# EAGLE design XU1541Mini (EAGLE 6.6.0)
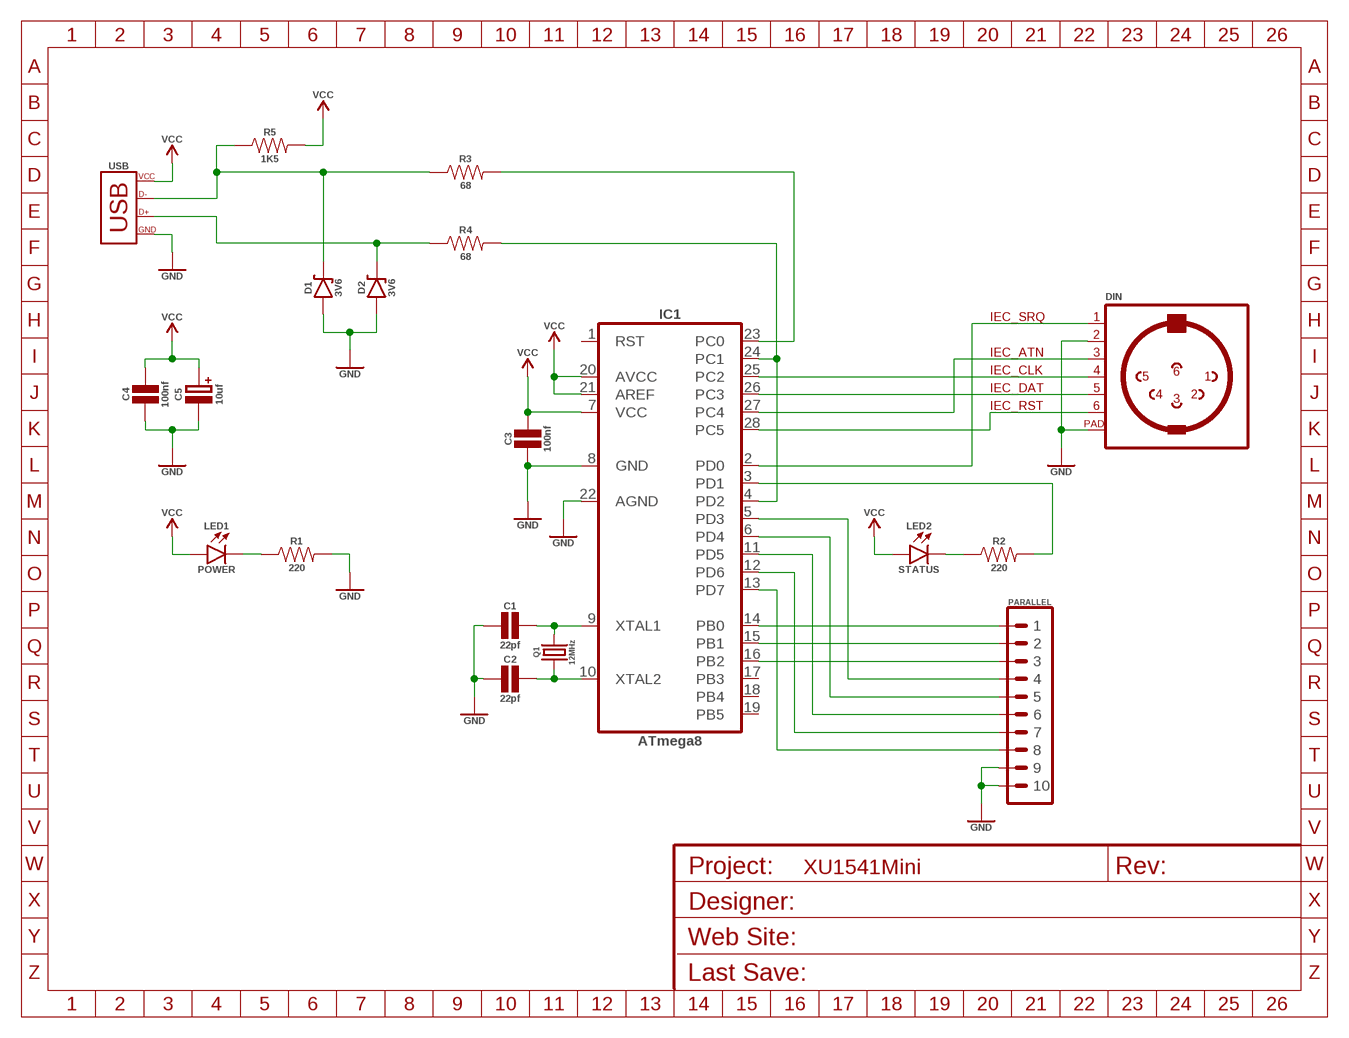
[diagram p0: schematic, sheet 1]
FRAME1 (FRAME_A5L): DESIGNER: Simon/CGTr; REVISION: 1.00; WEBSITE: http://www.commodore.gen.tr

## Parts
C1  22pf  CAPACITOR_CERAMIC_0.1  [CAPACITOR_CERAMIC_0.1]
C2  22pf  CAPACITOR_CERAMIC_0.1  [CAPACITOR_CERAMIC_0.1]
C3  100nf  CAPACITOR_CERAMIC_0.1  [CAPACITOR_CERAMIC_0.1]
C4  100nf  CAPACITOR_CERAMIC_0.1  [CAPACITOR_CERAMIC_0.1]
C5  10uf  CAPACITOR_POLARIZED_0.1  [CAPACITOR_POLARIZED_0.1]
D1  3V6  DIODE_ZENER_0.3  [DIODE_ZENER_0.3]
D2  3V6  DIODE_ZENER_0.3  [DIODE_ZENER_0.3]
DIN  DIN6  [DIN6]
IC1  ATmega8  MCU_ATMEGA8-16PU  [DIP28]
JP1  PARALLEL  HDR_2X05  [HDR_2X05]
LED1  POWER  LED_NORMAL_03MM  [LED_03MM]
LED2  STATUS  LED_NORMAL_03MM  [LED_03MM]
Q1  12MHz  XTAL_HC49  [XTAL_HC49]
R1  220  RESISTOR_THT_0.3  [RESISTOR_THT_0.3]
R2  220  RESISTOR_THT_0.3  [RESISTOR_THT_0.3]
R3  68  RESISTOR_THT_0.3  [RESISTOR_THT_0.3]
R4  68  RESISTOR_THT_0.3  [RESISTOR_THT_0.3]
R5  1K5  RESISTOR_THT_0.3  [RESISTOR_THT_0.3]
USB  USB_TYPEB_THT  [USB_TYPEB_THT]

## Nets
3@1: IC1.3(PD1) R2.2
3@2: LED2.CATHODE(C) R2.1
D+@1: D2.C(CATHODE) R4.1 USB.D+
D+@2: IC1.4(PD2) IC1.24(PC1) R4.2
D-@1: D1.C(CATHODE) R3.1 R5.1 USB.D-
D-@2: IC1.23(PC0) R3.2
GND: C1.1 C2.1 C3.1 C4.1 C5.2(-) D1.A(ANODE) D2.A(ANODE) DIN.2 DIN.PAD@1(PAD) DIN.PAD@2(PAD) IC1.8(GND) IC1.22(AGND) JP1.9 JP1.10 R1.2 USB.GND USB.PAD@1(GND) USB.PAD@2(GND)
IEC_ATN: DIN.3 IC1.27(PC4)
IEC_CLK: DIN.4 IC1.25(PC2)
IEC_DAT: DIN.5 IC1.26(PC3)
IEC_RST: DIN.6 IC1.28(PC5)
IEC_SRQ: DIN.1 IC1.2(PD0)
N$1: IC1.14(PB0) JP1.1
N$2: IC1.15(PB1) JP1.2
N$3: IC1.16(PB2) JP1.3
N$4: IC1.5(PD3) JP1.4
N$5: IC1.6(PD4) JP1.5
N$6: IC1.11(PD5) JP1.6
N$7: IC1.12(PD6) JP1.7
N$8: IC1.13(PD7) JP1.8
PWRLED: LED1.CATHODE(C) R1.1
VCC: C3.2 C4.2 C5.1(+) IC1.7(VCC) IC1.20(AVCC) IC1.21(AREF) LED1.ANODE(A) LED2.ANODE(A) R5.2 USB.VCC
XTAL1: C1.2 IC1.9(XTAL1) Q1.2
XTAL2: C2.2 IC1.10(XTAL2) Q1.1
Unconnected: IC1.1(RST) IC1.17(PB3) IC1.18(PB4) IC1.19(PB5)

## Notes on the sheet
- IEC_SRQ
- IEC_ATN
- IEC_CLK
- IEC_DAT
- IEC_RST

## Library data of the parts
C1-C4 = sj_standart:CAPACITOR_CERAMIC: Ceramic Capacitor
C5 = sj_standart:CAPACITOR_POLARIZED: Capacitor Polarized
D1 D2 = sj_standart:DIODE_ZENER: Zener Diode
DIN = sj_connectors:DIN6: 6pin DIN Connector
IC1 = sj_standart:MCU_ATMEGA8: ATMEGA8 MCU - 8 KB FLASH, 1 KB SRAM, 512 bytes EEPROM
JP1 = sj_connectors:HDR_2X05: 2x05 - 0.1" Pin Header
LED1 LED2 = sj_standart:LED_NORMAL: Standard LED
Q1 = sj_standart:XTAL: CRYSTAL
R1-R5 = sj_standart:RESISTOR: Resistor
USB = sj_connectors:USB: USB Connector

## Board
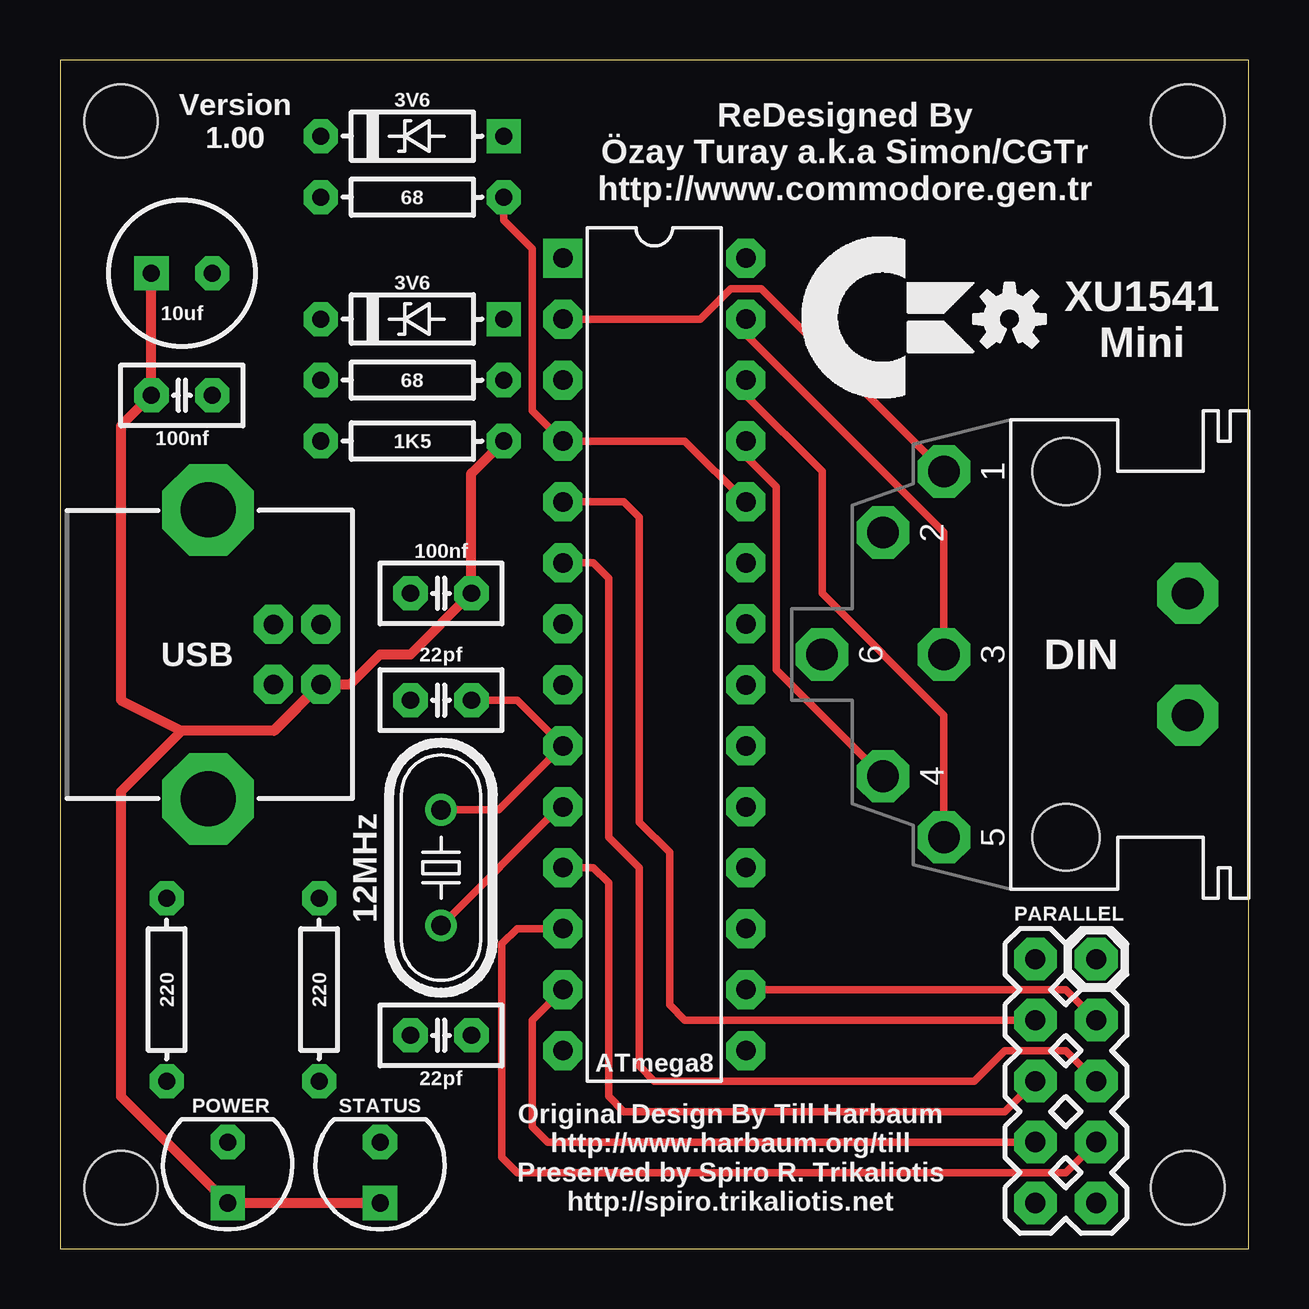
[diagram p1: board, top side]
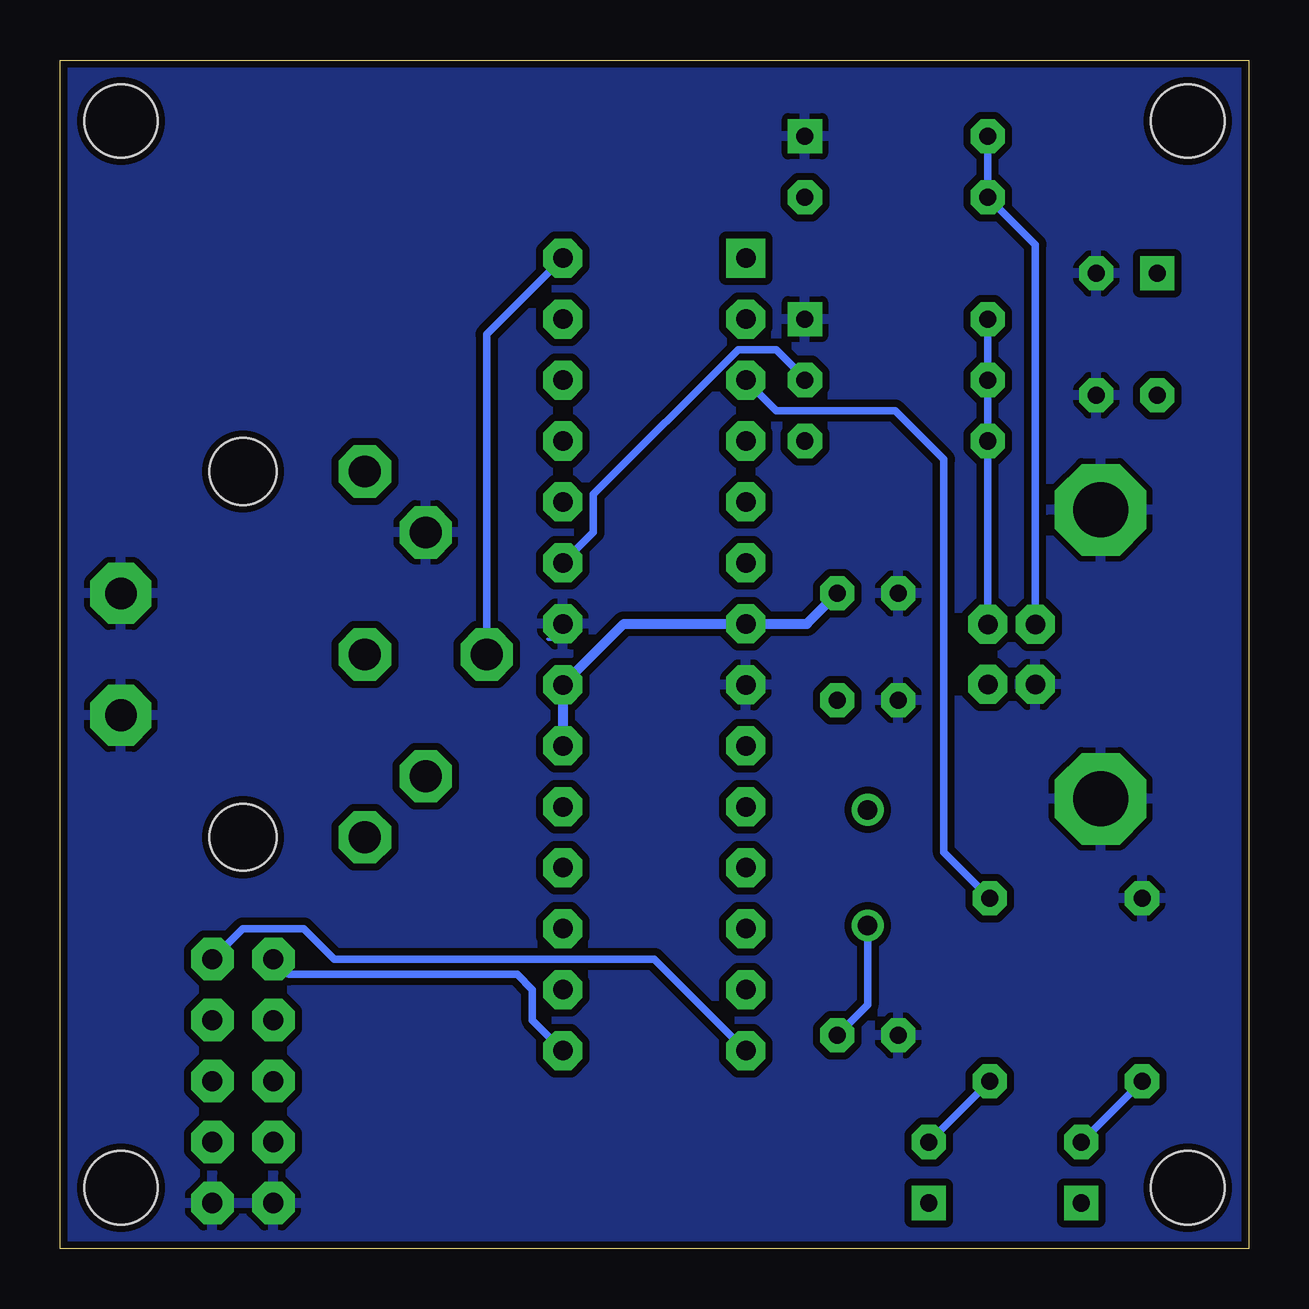
[diagram p2: board, bottom side, seen from below]

Size 49.53 x 49.53 mm. Coordinates in mm from the lower left corner, seen from the top.
Outline: 0,0 49.53,0 49.53,49.53 0,49.53 0,0
Copper layers (1*16): Top 0.035mm / dielectric 1.5mm / Bottom 0.035mm
Design rules "DirtyPCBs": minimum track width 5mil, minimum drill 12mil, track to track 5mil, track to pad 5mil, pad to pad 5mil, via to via 5mil, smd to smd 0mil, copper to edge 10mil, drill to drill 10mil, minimum pad ring 10mil, minimum via ring 6mil, stop-mask expansion 2mil, vias tented up to drill 25mil, thermal gap 10mil
Holes 3.05 mm at 2.54,2.54 2.54,46.99 46.99,46.99 46.99,2.54

### Footprints (pad centres in the part's own frame; a part is rotated, then mirrored left to right if it is on the bottom)
CAPACITOR_CERAMIC_0.1 = drill 0.711 pad 1.422 octagon: 1 -1.27,0; 2 1.27,0
CAPACITOR_POLARIZED_0.1 = drill 0.711 pad 1.422 square: 1 -1.27,0 | drill 0.711 pad 1.422 octagon: 2 1.27,0
DIODE_ZENER_0.3 = drill 0.711 pad 1.422 square: A -3.81,0 | drill 0.711 pad 1.422 octagon: C 3.81,0
DIN6 = drill 1.321 pad 2.184 octagon: 1 7.62,5.08; 2 5.08,7.62; 3 0,5.08; 4 -5.08,7.62; 5 -7.62,5.08; 6 0,10.16 | drill 1.321 pad 2.54 octagon: PAD@1 -2.54,-5.08; PAD@2 2.54,-5.08 | hole 2.794: 7.62,0; -7.62,0
DIP28 = drill 0.813 pad 1.626 square: 1 -16.51,-3.81 | drill 0.813 pad 1.626 octagon: 2 -13.97,-3.81; 3 -11.43,-3.81; 4 -8.89,-3.81; 5 -6.35,-3.81; 6 -3.81,-3.81; 7 -1.27,-3.81; 8 1.27,-3.81; 9 3.81,-3.81; 10 6.35,-3.81; 11 8.89,-3.81; 12 11.43,-3.81; 13 13.97,-3.81; 14 16.51,-3.81; 15 16.51,3.81; 16 13.97,3.81; 17 11.43,3.81; 18 8.89,3.81; 19 6.35,3.81; 20 3.81,3.81; 21 1.27,3.81; 22 -1.27,3.81; 23 -3.81,3.81; 24 -6.35,3.81; 25 -8.89,3.81; 26 -11.43,3.81; 27 -13.97,3.81; 28 -16.51,3.81
HDR_2X05 = drill 0.838 pad 1.778 octagon: 1 0,0; 2 0,-2.54; 3 2.54,0; 4 2.54,-2.54; 5 5.08,0; 6 5.08,-2.54; 7 7.62,0; 8 7.62,-2.54; 9 10.16,0; 10 10.16,-2.54
LED_03MM = drill 0.711 pad 1.422 square: ANODE -1.27,0 | drill 0.711 pad 1.422 octagon: CATHODE 1.27,0
XTAL_HC49 = drill 0.813: 1 -2.413,0; 2 2.413,0
RESISTOR_THT_0.3 = drill 0.711 pad 1.422 octagon: 1 -3.81,0; 2 3.81,0
USB_TYPEB_THT = drill 0.813 pad 1.626 octagon: D+ 5.08,1.25; D- 7.061,1.25; GND 5.08,-1.25; VCC 7.061,-1.25 | drill 2.286 pad 3.81 octagon: PAD@1 2.362,6.02; PAD@2 2.362,-6.02

### Placement (x,y rotation side)
C1  15.88,22.86 0 top
C2  15.88,8.89 0 top
C3  15.88,27.3 0 top
C4  5.08,35.56 180 top
C5  5.08,40.64 0 top
D1  14.68,38.73 180 top
D2  14.68,46.35 180 top
DIN  41.91,24.77 90 top
IC1  24.77,24.77 270 top
JP1  43.18,12.06 270 top
LED1  6.99,3.17 90 top
LED2  13.34,3.17 90 top
LOGO1  OSHW_LOGO_SMALL  [OSHW_LOGO_SMALL]  39.56,38.73 0 top
Q1  15.88,15.88 90 top
R1  4.45,10.79 90 top
R2  10.79,10.79 90 top
R3  14.68,36.2 0 top
R4  14.68,43.81 0 top
R5  14.68,33.66 0 top
USB  3.81,24.77 0 top

### Tracks (layer width: path | path; a pad name or v marks a point on that pad's centre or on a via)
3@1
  Bottom 0.305: R2.2 12.7,16.51 12.7,32.89 14.73,34.92 19.68,34.92 IC1.3
3@2
  Bottom 0.305: LED2.CATHODE R2.1
D+@1
  Bottom 0.305: USB.D+ 8.89,41.83 R4.1 D2.C
D+@2
  Top 0.305: R4.2 18.49,42.85 19.68,41.66 19.68,34.92 IC1.4 26.04,33.66 IC1.24
D-@1
  Bottom 0.305: USB.D- R5.1 R3.1 D1.C
D-@2
  Bottom 0.305: R3.2 18.49,36.27 19.68,37.47 21.27,37.47 27.3,31.43 27.3,29.84 IC1.23
GND
  Bottom 0.127: 29.21,25.4 28.57,25.4
  pour Bottom (isolate 0.305): 0,49.53 49.53,49.53 49.53,0 0,0
IEC_ATN
  Top 0.305: IC1.27 28.57,38.1 36.83,29.84 DIN.3
IEC_CLK
  Top 0.305: IC1.25 28.57,33.02 29.84,31.75 29.84,24.13 DIN.4
IEC_DAT
  Top 0.305: IC1.26 28.57,35.56 31.75,32.38 31.75,27.3 36.83,22.23 DIN.5
IEC_RST
  Bottom 0.305: IC1.28 31.75,38.1 DIN.6
IEC_SRQ
  Top 0.305: IC1.2 26.67,38.73 27.94,40.01 29.21,40.01 DIN.1
N$1
  Bottom 0.305: IC1.14 24.77,12.06 38.1,12.06 39.37,13.34 41.91,13.34 JP1.1
N$2
  Bottom 0.305: IC1.15 29.84,9.53 29.84,10.79 30.48,11.43 40.01,11.43 JP1.2
N$3
  Top 0.305: IC1.16 41.91,10.79 JP1.3
N$4
  Top 0.305: IC1.5 23.5,31.11 24.13,30.48 24.13,17.78 25.4,16.51 25.4,10.16 26.04,9.53 JP1.4
N$5
  Top 0.305: IC1.6 22.23,28.57 22.86,27.94 22.86,17.14 24.13,15.88 24.13,7.62 24.77,6.99 38.1,6.99 39.37,8.26 41.91,8.26 JP1.5
N$6
  Top 0.305: IC1.11 22.23,15.88 22.86,15.24 22.86,6.35 23.5,5.71 39.37,5.71 JP1.6
N$7
  Top 0.305: IC1.12 19.05,13.34 18.41,12.7 18.41,3.81 19.05,3.17 41.91,3.17 JP1.7
N$8
  Top 0.305: IC1.13 19.68,9.53 19.68,5.08 20.32,4.45 JP1.8
PWRLED
  Bottom 0.305: LED1.CATHODE R1.1
VCC
  Top 0.406: C5.1 C4.2 2.54,34.29 2.54,22.86 5.08,21.59 | 8.89,21.59 8.95,21.59 USB.VCC | USB.VCC 10.81,23.52 8.89,21.59 | 8.89,21.59 5.08,21.59 | 5.08,21.59 2.54,19.05 2.54,6.35 LED1.ANODE LED2.ANODE | USB.VCC 12.09,23.52 13.34,24.77 14.61,24.77 C3.2 17.14,32.32 17.16,32.32 R5.2
  Bottom 0.406: IC1.20 IC1.21 26.04,26.04 IC1.7 18.41,26.04 C3.2
XTAL1
  Top 0.305: Q1.2 18.29,18.29 IC1.9 19.05,22.86 C1.2
XTAL2
  Top 0.305: IC1.10 20.83,18.41 Q1.1
  Bottom 0.305: Q1.1 15.88,10.16 C2.2

### Text on the board
tPlace: Version / 1.00 | ReDesigned By / Özay Turay a.k.a Simon/CGTr / http://www.commodore.gen.tr | XU1541 / Mini | Original Design By Till Harbaum / http://www.harbaum.org/till / Preserved by Spiro R. Trikaliotis / http://spiro.trikaliotis.net